# EAGLE schematic IVEEDRIS-SCIR (EAGLE 9.0.1)

## Sheet 1 of 5
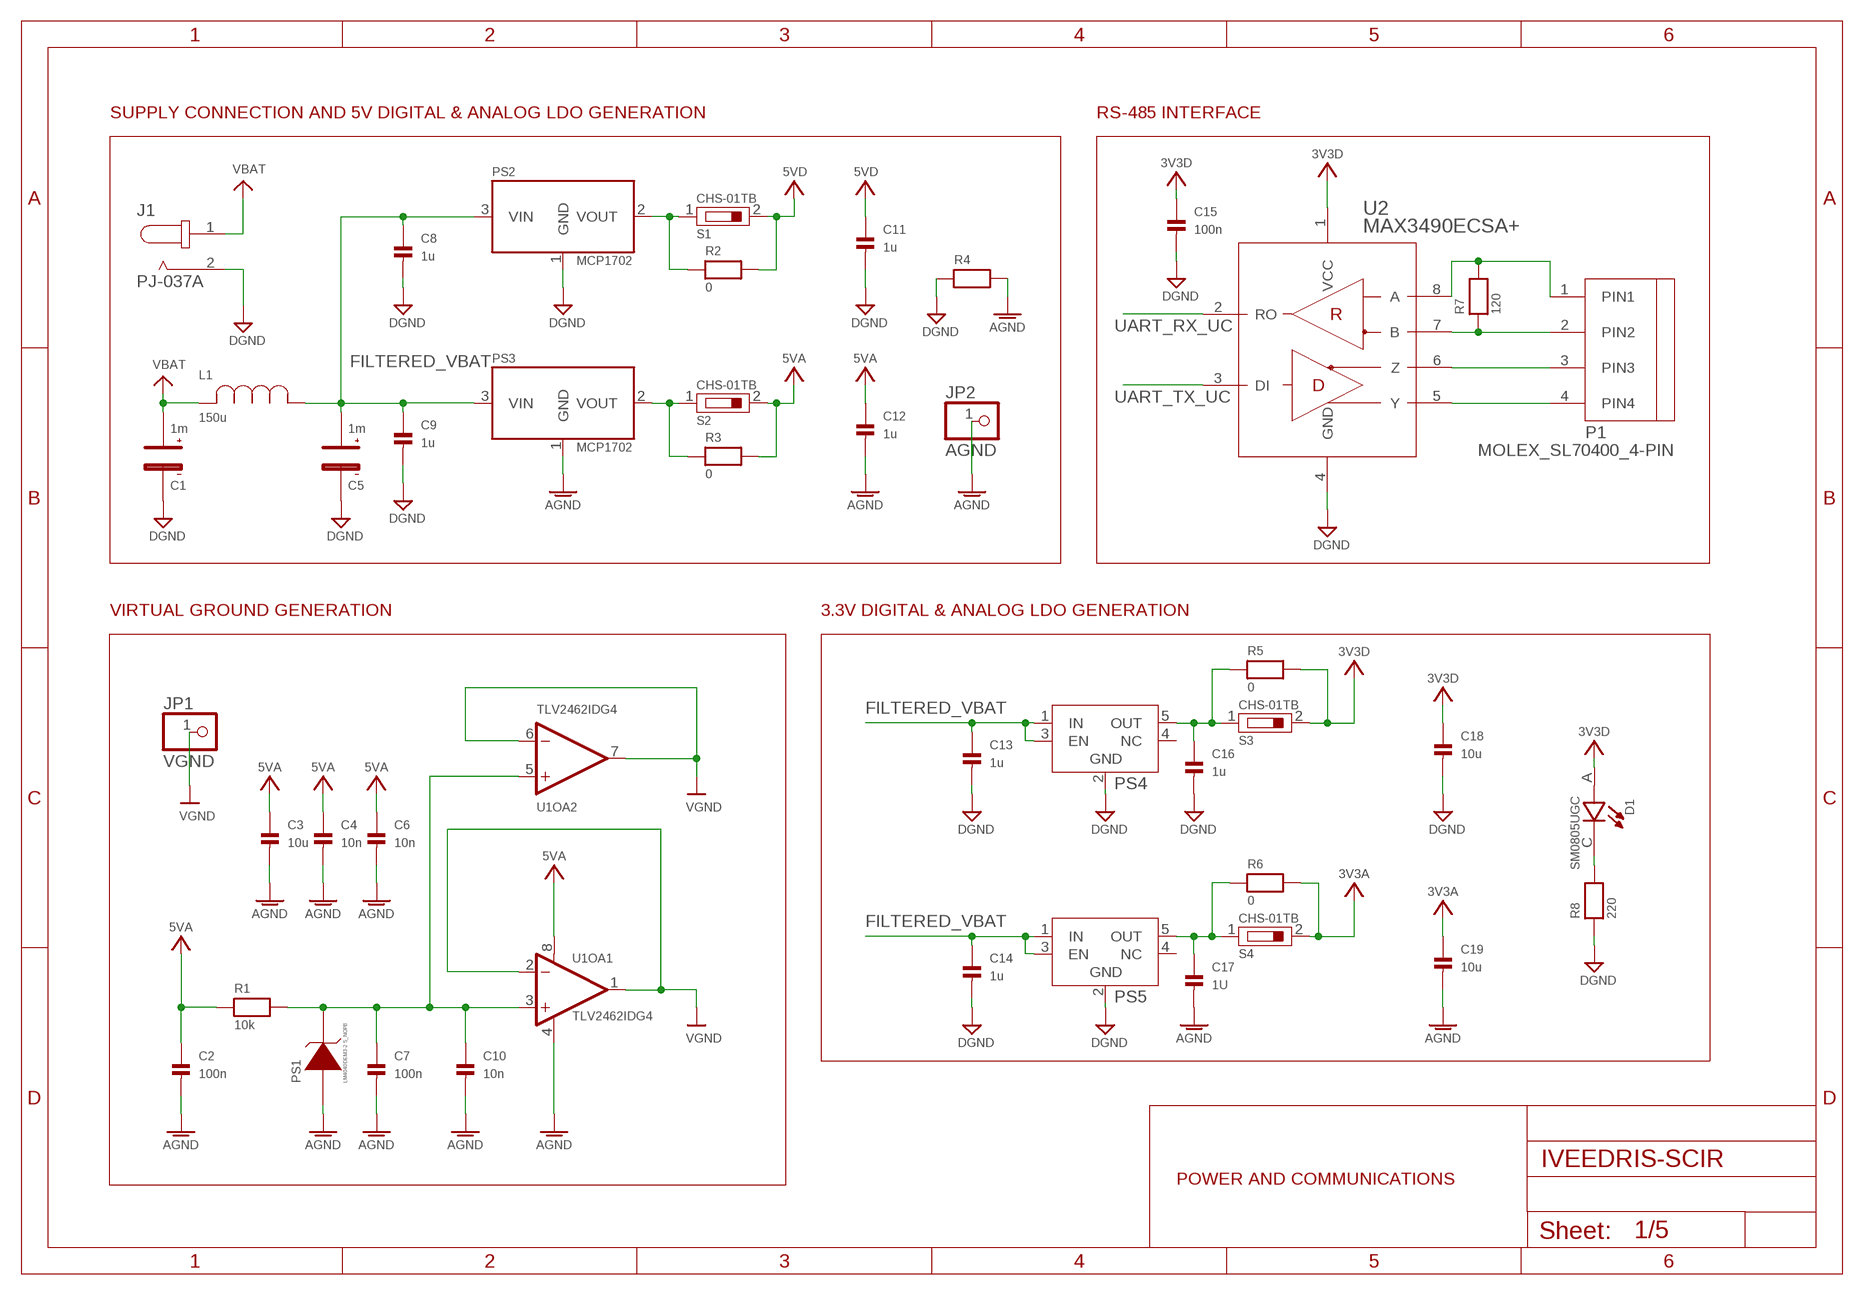
[diagram p0: schematic, sheet 1]

### Parts
C1  1m  APSG160ELL102MH20S  [CAP_ALUMINIUM]
C2  100n  CAP_CERAMIC0805  [0805]
C3  10u  CAP_CERAMIC0805  [0805]
C4  10n  CAP_CERAMIC0805  [0805]
C5  1m  APSG160ELL102MH20S  [CAP_ALUMINIUM]
C6  10n  CAP_CERAMIC0805  [0805]
C7  100n  CAP_CERAMIC0805  [0805]
C8  1u  CAP_CERAMIC0805  [0805]
C9  1u  CAP_CERAMIC0805  [0805]
C10  10n  CAP_CERAMIC0805  [0805]
C11  1u  CAP_CERAMIC0805  [0805]
C12  1u  CAP_CERAMIC0805  [0805]
C13  1u  CAP_CERAMIC0805  [0805]
C14  1u  CAP_CERAMIC0805  [0805]
C15  100n  CAP_CERAMIC0805  [0805]
C16  1u  CAP_CERAMIC0805  [0805]
C17  1U  CAP_CERAMIC0805  [0805]
C18  10u  CAP_CERAMIC0805  [0805]
C19  10u  CAP_CERAMIC0805  [0805]
D1  SM0805UGC  [LEDC2012X135N]
J1  PJ-037A  [CUI_PJ-037A]
JP1  VGND  HEADER-1X1  [1X01_OVAL]
JP2  AGND  HEADER-1X1  [1X01_OVAL]
L1  150u  PM3308-151M-RC  [IND_PM3308-RC]
P1  MOLEX_SL70400_4-PIN  [MOLEX_SL70400_4-PIN]
PS1  LM4040DEM3-2.5_NOPB  [SOT95P237X112-3N]
PS2  MCP1702  [SOT23-A]
PS3  MCP1702  [SOT23-A]
PS4  MCP1802T-3302I/OT  [TSOT-23_S5]
PS5  MCP1802T-3302I/OT  [TSOT-23_S5]
R1  10k  RESISTOR0805  [0805]
R2  0  RESISTOR0805  [0805]
R3  0  RESISTOR0805  [0805]
R4  RESISTOR0402  [0402]
R5  0  RESISTOR0805  [0805]
R6  0  RESISTOR0805  [0805]
R7  120  RESISTOR0805  [0805]
R8  220  RESISTOR0805  [0805]
S1  CHS-01TB  [CHS-01TB]
S2  CHS-01TB  [CHS-01TB]
S3  CHS-01TB  [CHS-01TB]
S4  CHS-01TB  [CHS-01TB]
U1  TLV2462IDG4  [SO8]
U2  MAX3490ECSA+  [SOIC127P600X175-8N]

### Nets
3V3A: C19.1 R6.2 S4.2 ; also sheet 2
3V3D: C15.1 C18.1 D1.A R5.2 S3.2 U2.1(VCC) ; also sheet 2
5VA: C2.1 C3.1 C4.1 C6.1 C12.1 R1.1 R3.2 S2.2 U1.8(OA1:V+) ; also sheet 4
5VD: C11.1 R2.2 S1.2 ; also sheet 3
AGND: C2.2 C3.2 C4.2 C6.2 C7.2 C10.2 C12.2 C17.2 C19.2 JP2.1 PS1.2(ANODE) PS3.1(GND) R4.2 U1.4(OA1:V-) ; also sheet 2,4,5
DGND: C1.2 C5.2 C8.2 C9.2 C11.2 C13.2 C14.2 C15.2 C16.2 C18.2 J1.2 PS2.1(GND) PS4.2(GND) PS5.2(GND) R4.1 R8.1 U2.4(GND) ; also sheet 2,3
FILTERED_VBAT: C5.1 C8.1 C9.1 C13.1 C14.1 L1.1 PS2.3(VIN) PS3.3(VIN) PS4.1(IN) PS4.3(EN) PS5.1(IN) PS5.3(EN)
N$11: PS3.2(VOUT) R3.1 S2.1
N$14: P1.4(PIN4) U2.5(Y)
N$17: C7.1 C10.1 PS1.1(CATHODE) R1.2 U1.3(OA1:+IN) U1.5(OA2:+IN)
N$21: PS2.2(VOUT) R2.1 S1.1
N$23: P1.3(PIN3) U2.6(Z)
N$29: C17.1 PS5.5(OUT) R6.1 S4.1
N$30: C16.1 PS4.5(OUT) R5.1 S3.1
N$36: D1.C R8.2
N$40: P1.2(PIN2) R7.1 U2.7(B)
N$41: P1.1(PIN1) R7.2 U2.8(A)
UART_RX_UC: U2.2(RO) ; also sheet 2
UART_TX_UC: U2.3(DI) ; also sheet 2
VBAT: C1.1 J1.1 L1.2
VGND: JP1.1 U1.1(OA1:OUT) U1.2(OA1:-IN) U1.6(OA2:-IN) U1.7(OA2:OUT) ; also sheet 4,5
Unconnected: PS1.3(NC) PS4.4(NC) PS5.4(NC)

### Notes on the sheet
- SUPPLY CONNECTION AND 5V DIGITAL & ANALOG LDO GENERATION | RS-485 INTERFACE
- VIRTUAL GROUND GENERATION | 3.3V DIGITAL & ANALOG LDO GENERATION
- POWER AND COMMUNICATIONS

## Sheet 2 of 5
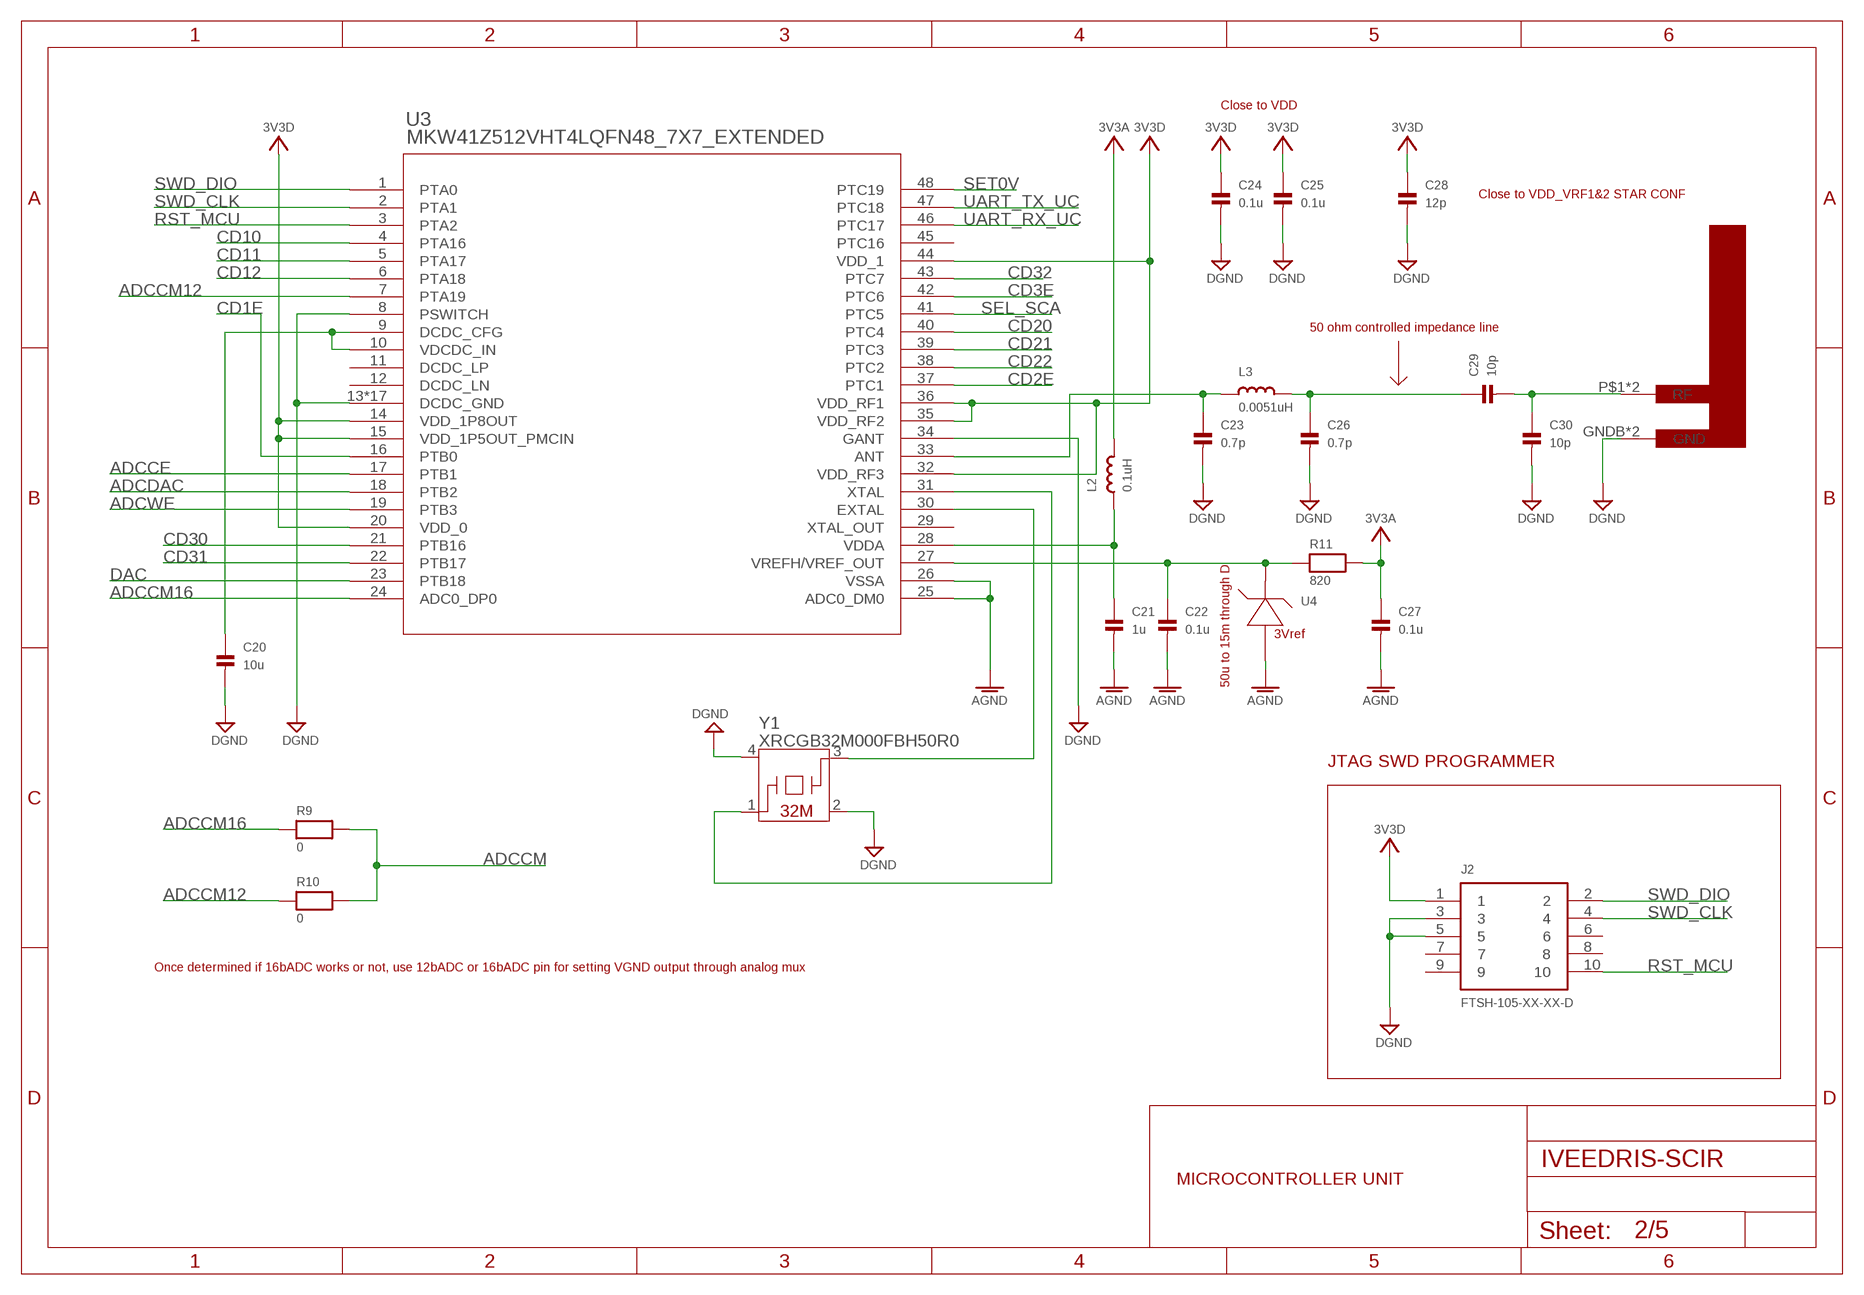
[diagram p1: schematic, sheet 2]

### Parts
AE1  F_INVERTED_ANTENNA_2.4G  [RF2.4GHZ_FINVERTED_ANTENNA]
C20  10u  CAP_CERAMIC0805  [0805]
C21  1u  CAP_CERAMIC0805  [0805]
C22  0.1u  CAP_CERAMIC0805  [0805]
C23  0.7p  CAP_CERAMIC0805  [0805]
C24  0.1u  CAP_CERAMIC0805  [0805]
C25  0.1u  CAP_CERAMIC0805  [0805]
C26  0.7p  CAP_CERAMIC0805  [0805]
C27  0.1u  CAP_CERAMIC0805  [0805]
C28  12p  CAP_CERAMIC0805  [0805]
C29  10p  CAP_CERAMIC0805  [0805]
C30  10p  CAP_CERAMIC0805  [0805]
J2  FTSH-105-XX-XX-D  [FTSH-105-XX-XX-D]
L2  0.1uH  INDUCTOR0805  [0805]
L3  0.0051uH  INDUCTOR0805  [0805]
R9  0  RESISTOR0805  [0805]
R10  0  RESISTOR0805  [0805]
R11  820  RESISTOR0805  [0805]
U3  MKW41Z512VHT4LQFN48_7X7_EXTENDED  [LQFN48_7X7_EXTENDED]
U4  ADR5043BKSZ-REEL7KS_3_ADI-M  [KS_3_ADI-M]
Y1  XRCGB32M000FBH50R0  [XRCGB32_F]

### Nets
3V3A: C27.1 L2.2 R11.2 ; also sheet 1
3V3D: C24.1 C25.1 C28.1 J2.1 U3.14(VDD_1P8OUT) U3.15(VDD_1P5OUT_PMCIN) U3.20(VDD_0) U3.32(VDD_RF3) U3.35(VDD_RF2) U3.36(VDD_RF1) U3.44(VDD_1) ; also sheet 1
ADCCE: U3.17(PTB1) ; also sheet 4
ADCCM: R9.2 R10.2 ; also sheet 4
ADCCM12: R10.1 U3.7(PTA19)
ADCCM16: R9.1 U3.24(ADC0_DP0)
ADCDAC: U3.18(PTB2) ; also sheet 4
ADCWE: U3.19(PTB3) ; also sheet 4
AGND: C21.2 C22.2 C27.2 U3.25(ADC0_DM0) U3.26(VSSA) U4.2(V-) ; also sheet 1,4,5
CD1E: U3.16(PTB0) ; also sheet 3
CD2E: U3.37(PTC1) ; also sheet 3
CD3E: U3.42(PTC6) ; also sheet 3
CD10: U3.4(PTA16) ; also sheet 3
CD11: U3.5(PTA17) ; also sheet 3
CD12: U3.6(PTA18) ; also sheet 3
CD20: U3.40(PTC4) ; also sheet 3
CD21: U3.39(PTC3) ; also sheet 3
CD22: U3.38(PTC2) ; also sheet 3
CD30: U3.21(PTB16) ; also sheet 3
CD31: U3.22(PTB17) ; also sheet 3
CD32: U3.43(PTC7) ; also sheet 3
DAC: U3.23(PTB18) ; also sheet 4
DGND: AE1.GNDB(GND) AE1.GNDT(GND) C20.2 C23.2 C24.2 C25.2 C26.2 C28.2 C30.2 J2.3 J2.5 U3.8(PSWITCH) U3.13(DCDC_GND) U3.34(GANT) U3.49(DCDC_GND) U3.50(DCDC_GND) U3.51(DCDC_GND) U3.52(DCDC_GND) U3.53(DCDC_GND) U3.54(DCDC_GND) U3.55(DCDC_GND) U3.56(DCDC_GND) U3.57(DCDC_GND) U3.58(DCDC_GND) U3.59(DCDC_GND) U3.60(DCDC_GND) U3.61(DCDC_GND) U3.62(DCDC_GND) U3.63(DCDC_GND) U3.64(DCDC_GND) Y1.2(NC_1) Y1.4(NC_2) ; also sheet 1,3
N$2: C21.1 L2.1 U3.28(VDDA)
N$12: C20.1 U3.9(DCDC_CFG) U3.10(VDCDC_IN)
N$20: C22.1 R11.1 U3.27(VREFH/VREF_OUT) U4.1(V+)
N$31: U3.31(XTAL) Y1.1(CRYSTAL_1)
N$32: U3.30(EXTAL) Y1.3(CRYSTAL_2)
N$33: C23.1 L3.1 U3.33(ANT)
N$34: C26.1 C29.1 L3.2
N$35: AE1.P$1(RF) AE1.RF C29.2 C30.1
RST_MCU: J2.10 U3.3(PTA2)
SEL_SCA: U3.41(PTC5) ; also sheet 4
SET0V: U3.48(PTC19) ; also sheet 4
SWD_CLK: J2.4 U3.2(PTA1)
SWD_DIO: J2.2 U3.1(PTA0)
UART_RX_UC: U3.46(PTC17) ; also sheet 1
UART_TX_UC: U3.47(PTC18) ; also sheet 1
Unconnected: J2.6 J2.7 J2.8 J2.9 U3.11(DCDC_LP) U3.12(DCDC_LN) U3.29(XTAL_OUT) U3.45(PTC16) U4.3(NC)

### Notes on the sheet
- Close to VDD
- Close to VDD_VRF1&2 STAR CONF
- 50 ohm controlled impedance line
- 50u to 15m through D
- JTAG SWD PROGRAMMER
- Once determined if 16bADC works or not, use 12bADC or 16bADC pin for setting VGND output through analog mux
- MICROCONTROLLER UNIT

## Sheet 3 of 5
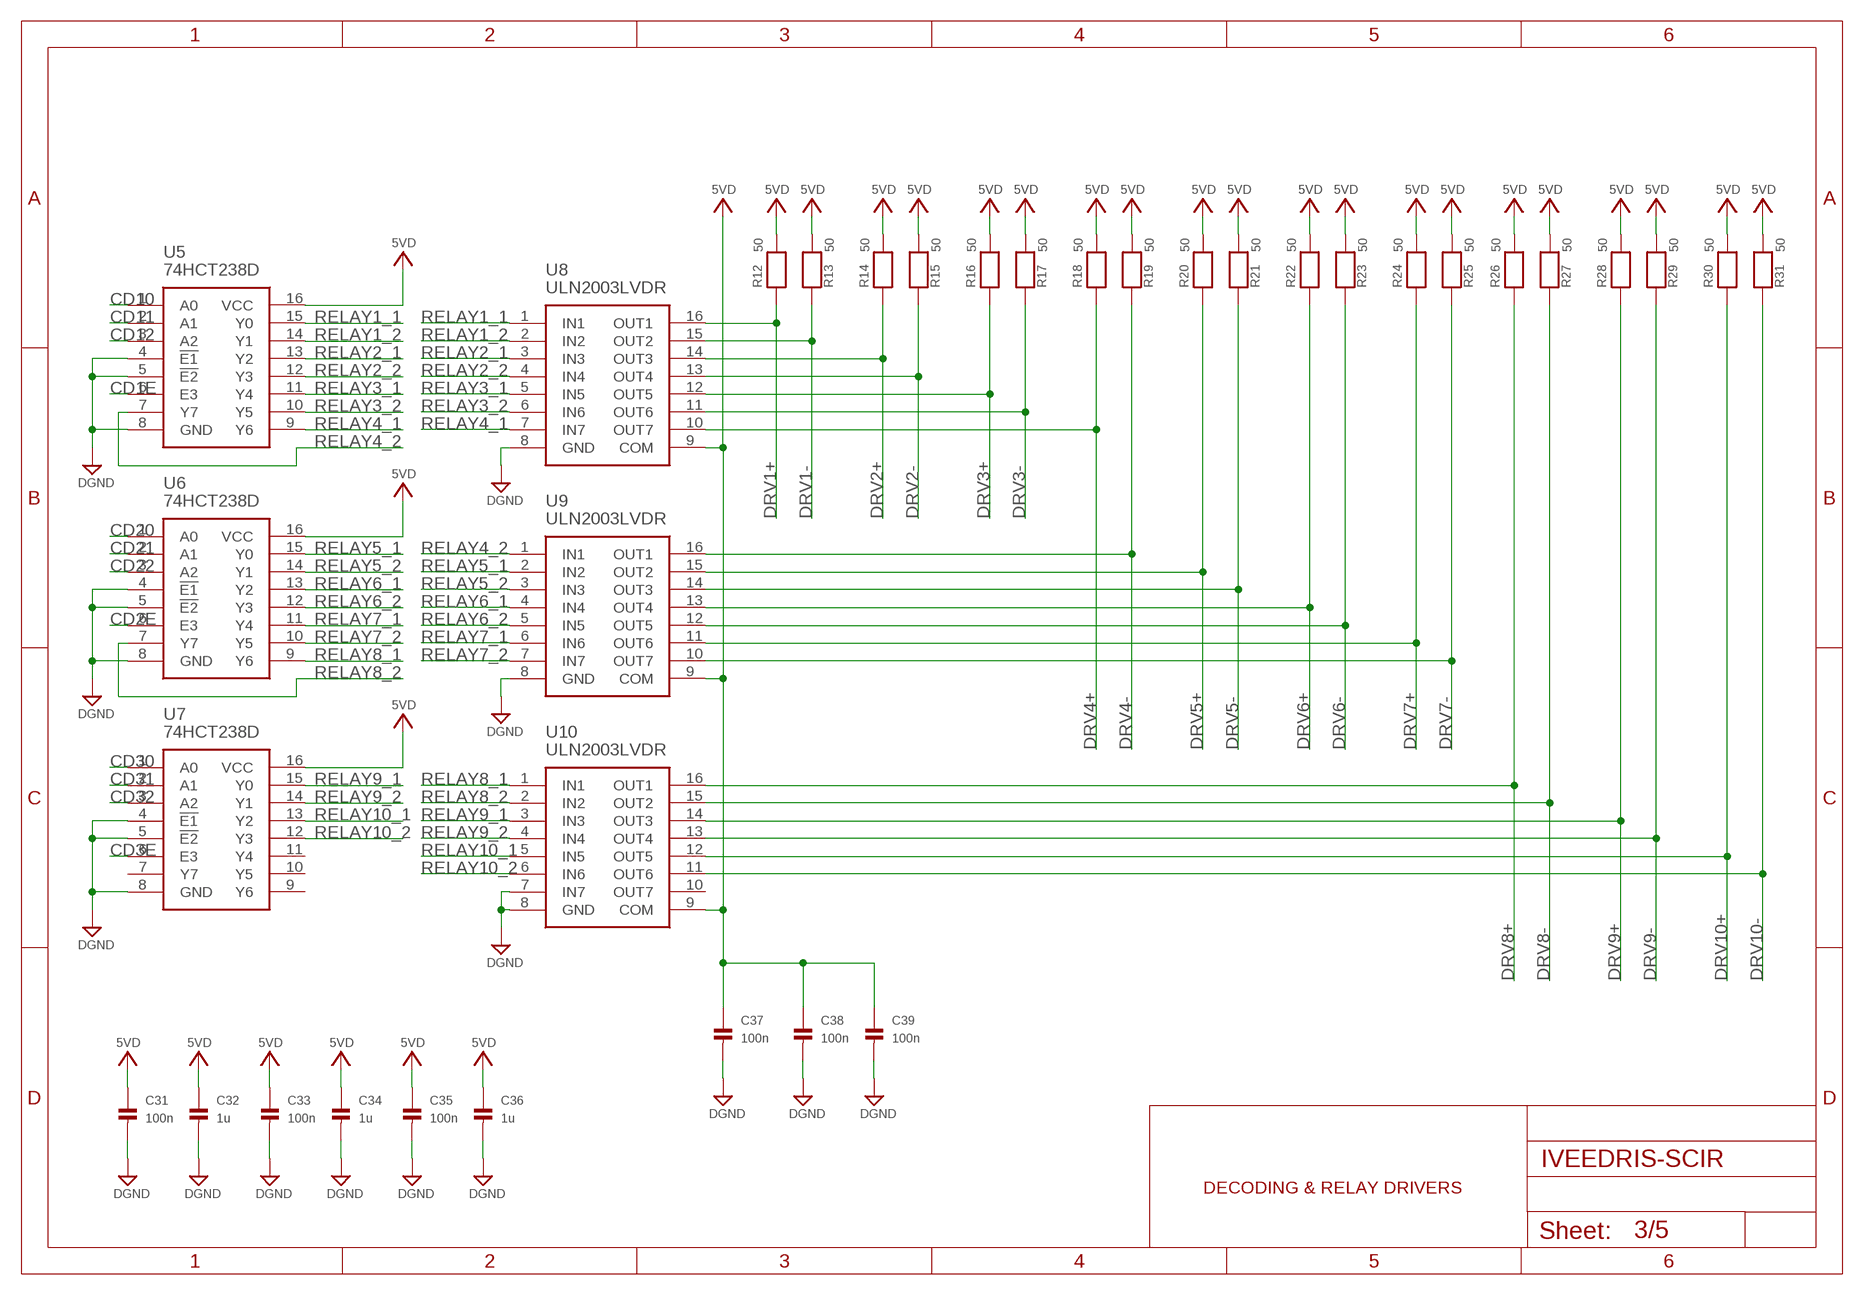
[diagram p2: schematic, sheet 3]

### Parts
C31  100n  CAP_CERAMIC0805  [0805]
C32  1u  CAP_CERAMIC0805  [0805]
C33  100n  CAP_CERAMIC0805  [0805]
C34  1u  CAP_CERAMIC0805  [0805]
C35  100n  CAP_CERAMIC0805  [0805]
C36  1u  CAP_CERAMIC0805  [0805]
C37  100n  CAP_CERAMIC0805  [0805]
C38  100n  CAP_CERAMIC0805  [0805]
C39  100n  CAP_CERAMIC0805  [0805]
R12  50  RESISTOR0805  [0805]
R13  50  RESISTOR0805  [0805]
R14  50  RESISTOR0805  [0805]
R15  50  RESISTOR0805  [0805]
R16  50  RESISTOR0805  [0805]
R17  50  RESISTOR0805  [0805]
R18  50  RESISTOR0805  [0805]
R19  50  RESISTOR0805  [0805]
R20  50  RESISTOR0805  [0805]
R21  50  RESISTOR0805  [0805]
R22  50  RESISTOR0805  [0805]
R23  50  RESISTOR0805  [0805]
R24  50  RESISTOR0805  [0805]
R25  50  RESISTOR0805  [0805]
R26  50  RESISTOR0805  [0805]
R27  50  RESISTOR0805  [0805]
R28  50  RESISTOR0805  [0805]
R29  50  RESISTOR0805  [0805]
R30  50  RESISTOR0805  [0805]
R31  50  RESISTOR0805  [0805]
U5  74HCT238D  [SOIC127P600X175-16N]
U6  74HCT238D  [SOIC127P600X175-16N]
U7  74HCT238D  [SOIC127P600X175-16N]
U8  ULN2003LVDR  [SOIC127P600X175-16N]
U9  ULN2003LVDR  [SOIC127P600X175-16N]
U10  ULN2003LVDR  [SOIC127P600X175-16N]

### Nets
5VD: C31.1 C32.1 C33.1 C34.1 C35.1 C36.1 C37.1 C38.1 C39.1 R12.2 R13.2 R14.2 R15.2 R16.2 R17.2 R18.2 R19.2 R20.2 R21.2 R22.2 R23.2 R24.2 R25.2 R26.2 R27.2 R28.2 R29.2 R30.2 R31.2 U5.16(VCC) U6.16(VCC) U7.16(VCC) U8.9(COM) U9.9(COM) U10.9(COM) ; also sheet 1
CD1E: U5.6(E3) ; also sheet 2
CD2E: U6.6(E3) ; also sheet 2
CD3E: U7.6(E3) ; also sheet 2
CD10: U5.1(A0) ; also sheet 2
CD11: U5.2(A1) ; also sheet 2
CD12: U5.3(A2) ; also sheet 2
CD20: U6.1(A0) ; also sheet 2
CD21: U6.2(A1) ; also sheet 2
CD22: U6.3(A2) ; also sheet 2
CD30: U7.1(A0) ; also sheet 2
CD31: U7.2(A1) ; also sheet 2
CD32: U7.3(A2) ; also sheet 2
DGND: C31.2 C32.2 C33.2 C34.2 C35.2 C36.2 C37.2 C38.2 C39.2 U5.4(!E1) U5.5(!E2) U5.8(GND) U6.4(!E1) U6.5(!E2) U6.8(GND) U7.4(!E1) U7.5(!E2) U7.8(GND) U8.8(GND) U9.8(GND) U10.7(IN7) U10.8(GND) ; also sheet 1,2
DRV1+: R12.1 U8.16(OUT1) ; also sheet 5
DRV1-: R13.1 U8.15(OUT2) ; also sheet 5
DRV2+: R14.1 U8.14(OUT3) ; also sheet 5
DRV2-: R15.1 U8.13(OUT4) ; also sheet 5
DRV3+: R16.1 U8.12(OUT5) ; also sheet 5
DRV3-: R17.1 U8.11(OUT6) ; also sheet 5
DRV4+: R18.1 U8.10(OUT7) ; also sheet 5
DRV4-: R19.1 U9.16(OUT1) ; also sheet 5
DRV5+: R20.1 U9.15(OUT2) ; also sheet 5
DRV5-: R21.1 U9.14(OUT3) ; also sheet 5
DRV6+: R22.1 U9.13(OUT4) ; also sheet 5
DRV6-: R23.1 U9.12(OUT5) ; also sheet 5
DRV7+: R24.1 U9.11(OUT6) ; also sheet 5
DRV7-: R25.1 U9.10(OUT7) ; also sheet 5
DRV8+: R26.1 U10.16(OUT1) ; also sheet 5
DRV8-: R27.1 U10.15(OUT2) ; also sheet 5
DRV9+: R28.1 U10.14(OUT3) ; also sheet 5
DRV9-: R29.1 U10.13(OUT4) ; also sheet 5
DRV10+: R30.1 U10.12(OUT5) ; also sheet 5
DRV10-: R31.1 U10.11(OUT6) ; also sheet 5
RELAY1_1: U5.15(Y0) U8.1(IN1)
RELAY1_2: U5.14(Y1) U8.2(IN2)
RELAY2_1: U5.13(Y2) U8.3(IN3)
RELAY2_2: U5.12(Y3) U8.4(IN4)
RELAY3_1: U5.11(Y4) U8.5(IN5)
RELAY3_2: U5.10(Y5) U8.6(IN6)
RELAY4_1: U5.9(Y6) U8.7(IN7)
RELAY4_2: U5.7(Y7) U9.1(IN1)
RELAY5_1: U6.15(Y0) U9.2(IN2)
RELAY5_2: U6.14(Y1) U9.3(IN3)
RELAY6_1: U6.13(Y2) U9.4(IN4)
RELAY6_2: U6.12(Y3) U9.5(IN5)
RELAY7_1: U6.11(Y4) U9.6(IN6)
RELAY7_2: U6.10(Y5) U9.7(IN7)
RELAY8_1: U6.9(Y6) U10.1(IN1)
RELAY8_2: U6.7(Y7) U10.2(IN2)
RELAY9_1: U7.15(Y0) U10.3(IN3)
RELAY9_2: U7.14(Y1) U10.4(IN4)
RELAY10_1: U7.13(Y2) U10.5(IN5)
RELAY10_2: U7.12(Y3) U10.6(IN6)
Unconnected: U7.7(Y7) U7.9(Y6) U7.10(Y5) U7.11(Y4) U10.10(OUT7)

### Notes on the sheet
- DECODING & RELAY DRIVERS

## Sheet 4 of 5
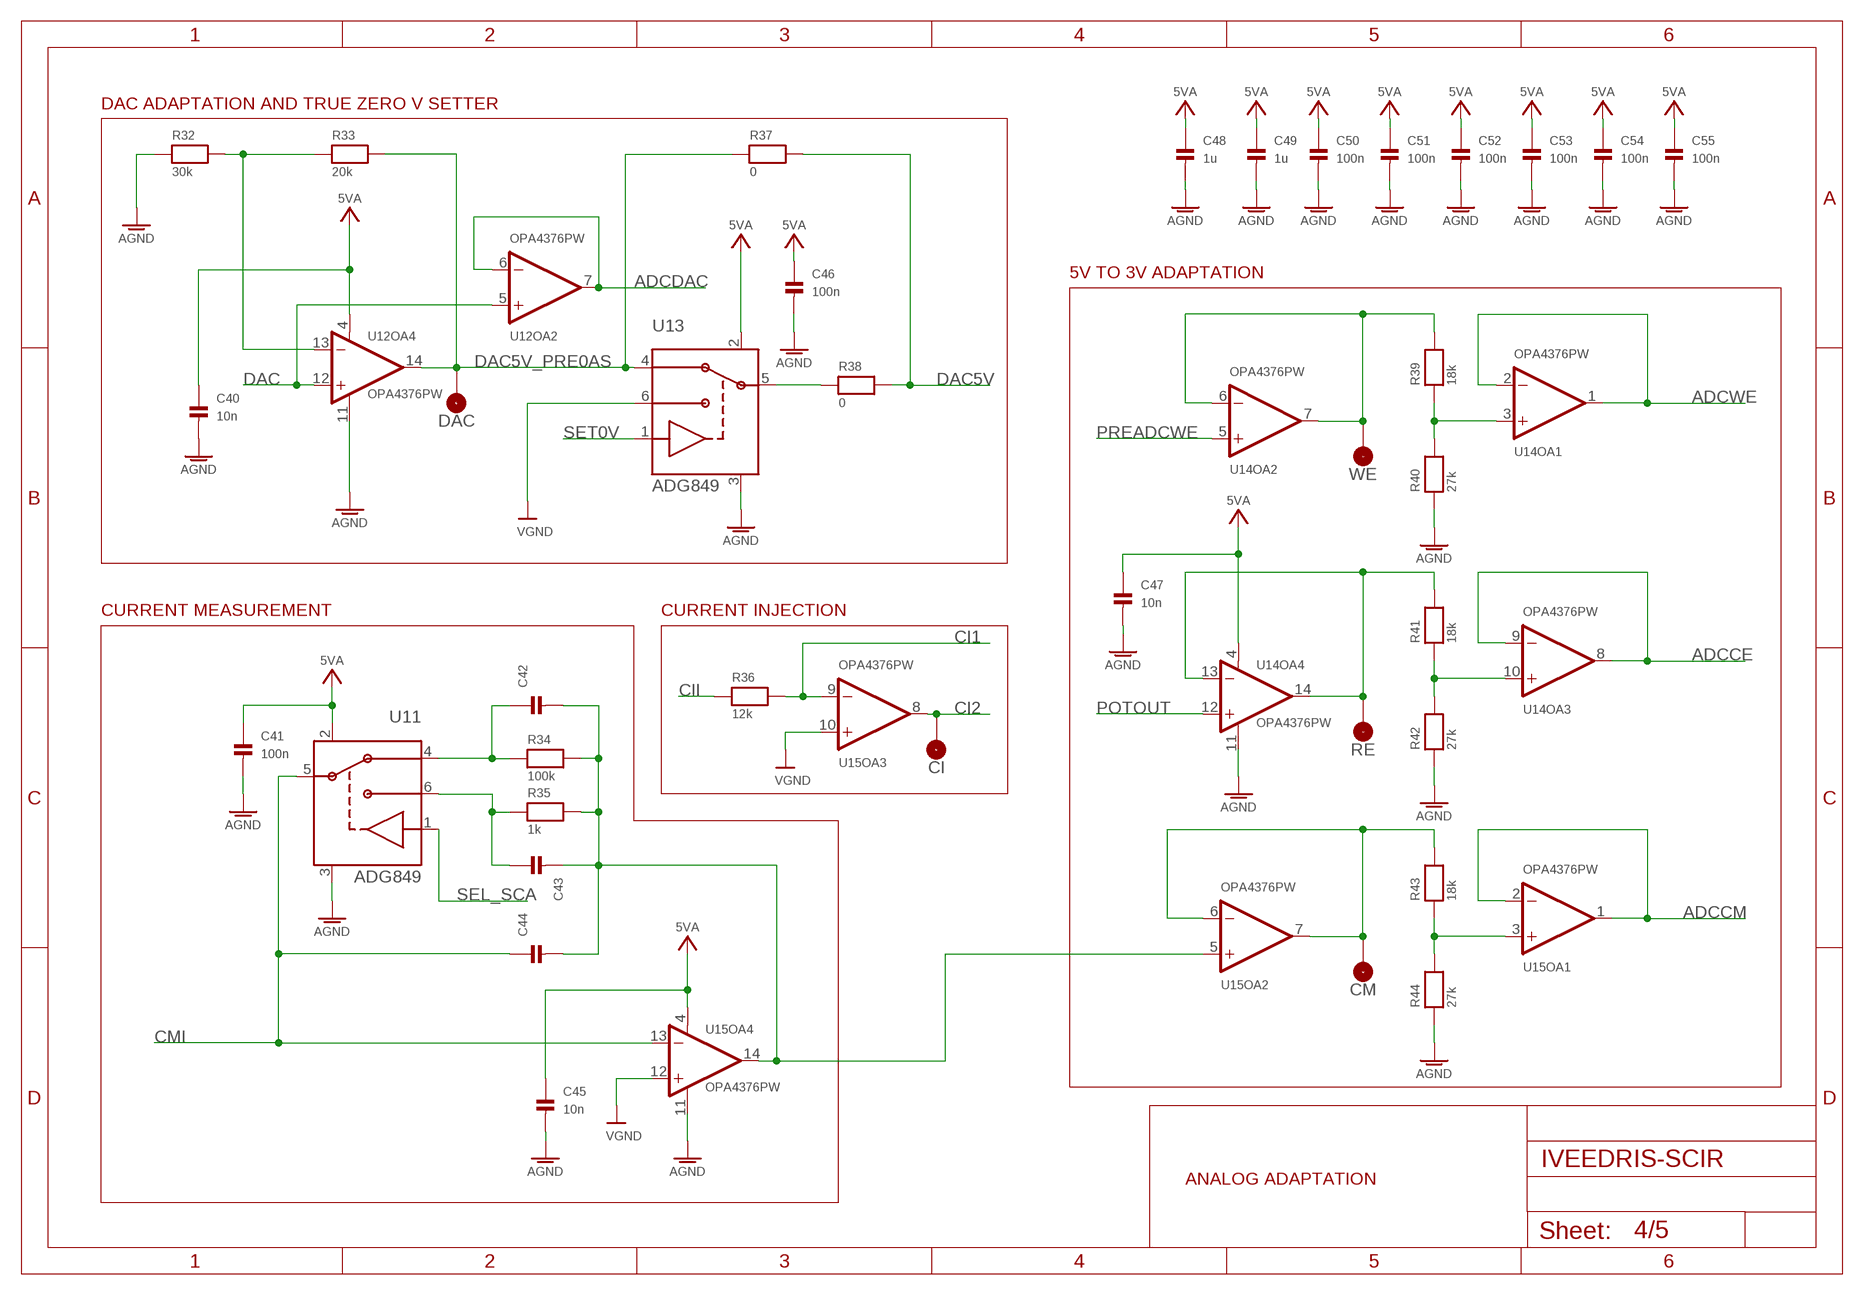
[diagram p3: schematic, sheet 4]

### Parts
C40  10n  CAP_CERAMIC0805  [0805]
C41  100n  CAP_CERAMIC0805  [0805]
C42  CAP_CERAMIC0805  [0805]
C43  CAP_CERAMIC0805  [0805]
C44  CAP_CERAMIC0805  [0805]
C45  10n  CAP_CERAMIC0805  [0805]
C46  100n  CAP_CERAMIC0805  [0805]
C47  10n  CAP_CERAMIC0805  [0805]
C48  1u  CAP_CERAMIC0805  [0805]
C49  1u  CAP_CERAMIC0805  [0805]
C50  100n  CAP_CERAMIC0805  [0805]
C51  100n  CAP_CERAMIC0805  [0805]
C52  100n  CAP_CERAMIC0805  [0805]
C53  100n  CAP_CERAMIC0805  [0805]
C54  100n  CAP_CERAMIC0805  [0805]
C55  100n  CAP_CERAMIC0805  [0805]
CI  TESTPOINT  [NOSOLDERPAD]
CM  TESTPOINT  [NOSOLDERPAD]
DAC  TESTPOINT  [NOSOLDERPAD]
R32  30k  RESISTOR0805  [0805]
R33  20k  RESISTOR0805  [0805]
R34  100k  RESISTOR1206  [1206]
R35  1k  RESISTOR1206  [1206]
R36  12k  RESISTOR1206  [1206]
R37  0  RESISTOR0805  [0805]
R38  0  RESISTOR0805  [0805]
R39  18k  RESISTOR0805  [0805]
R40  27k  RESISTOR0805  [0805]
R41  18k  RESISTOR0805  [0805]
R42  27k  RESISTOR0805  [0805]
R43  18k  RESISTOR0805  [0805]
R44  27k  RESISTOR0805  [0805]
RE  TESTPOINT  [NOSOLDERPAD]
U11  ADG849  [SC70-6L]
U12  OPA4376PW  [TSSOP14-NOTHERMALPAD]
U13  ADG849  [SC70-6L]
U14  OPA4376PW  [TSSOP14-NOTHERMALPAD]
U15  OPA4376PW  [TSSOP14-NOTHERMALPAD]
WE  TESTPOINT  [NOSOLDERPAD]

### Nets
5VA: C40.1 C41.1 C45.1 C46.1 C47.1 C48.1 C49.1 C50.1 C51.1 C52.1 C53.1 C54.1 C55.1 U11.2(VDD) U12.4(OA4:V+) U13.2(VDD) U14.4(OA4:V+) U15.4(OA4:V+) ; also sheet 1
ADCCE: U14.8(OA3:OUT) U14.9(OA3:-IN) ; also sheet 2
ADCCM: U15.1(OA1:OUT) U15.2(OA1:-IN) ; also sheet 2
ADCDAC: U12.6(OA2:-IN) U12.7(OA2:OUT) ; also sheet 2
ADCWE: U14.1(OA1:OUT) U14.2(OA1:-IN) ; also sheet 2
AGND: C40.2 C41.2 C45.2 C46.2 C47.2 C48.2 C49.2 C50.2 C51.2 C52.2 C53.2 C54.2 C55.2 R32.1 R40.1 R42.1 R44.1 U11.3(GND) U12.11(OA4:V-) U13.3(GND) U14.11(OA4:V-) U15.11(OA4:V-) ; also sheet 1,2,5
CI1: R36.2 U15.9(OA3:-IN) ; also sheet 5
CI2: CI.P$1 U15.8(OA3:OUT) ; also sheet 5
CII: R36.1 ; also sheet 5
CMI: C44.1 U11.5(D) U15.13(OA4:-IN) ; also sheet 5
DAC: U12.5(OA2:+IN) U12.12(OA4:+IN) ; also sheet 2
DAC5V: R37.2 R38.2 ; also sheet 5
DAC5V_PRE0AS: DAC.P$1 R33.2 R37.1 U12.14(OA4:OUT) U13.4(S1)
HHHHH: C42.2 C43.2 C44.2 R34.2 R35.2 U15.5(OA2:+IN) U15.14(OA4:OUT)
N$1: R38.1 U13.5(D)
N$3: R41.1 R42.2 U14.10(OA3:+IN)
N$8: R43.1 R44.2 U15.3(OA1:+IN)
N$9: R41.2 RE.P$1 U14.13(OA4:-IN) U14.14(OA4:OUT)
N$13: R39.1 R40.2 U14.3(OA1:+IN)
N$18: R39.2 U14.6(OA2:-IN) U14.7(OA2:OUT) WE.P$1
N$22: CM.P$1 R43.2 U15.6(OA2:-IN) U15.7(OA2:OUT)
N$24: R32.2 R33.1 U12.13(OA4:-IN)
N$47: C42.1 R34.1 U11.4(S1)
N$48: C43.1 R35.1 U11.6(S2)
POTOUT: U14.12(OA4:+IN) ; also sheet 5
PREADCWE: U14.5(OA2:+IN) ; also sheet 5
SEL_SCA: U11.1(IN) ; also sheet 2
SET0V: U13.1(IN) ; also sheet 2
VGND: U13.6(S2) U15.10(OA3:+IN) U15.12(OA4:+IN) ; also sheet 1,5

### Notes on the sheet
- DAC ADAPTATION AND TRUE ZERO V SETTER
- 5V TO 3V ADAPTATION
- CURRENT MEASUREMENT | CURRENT INJECTION
- ANALOG ADAPTATION

## Sheet 5 of 5
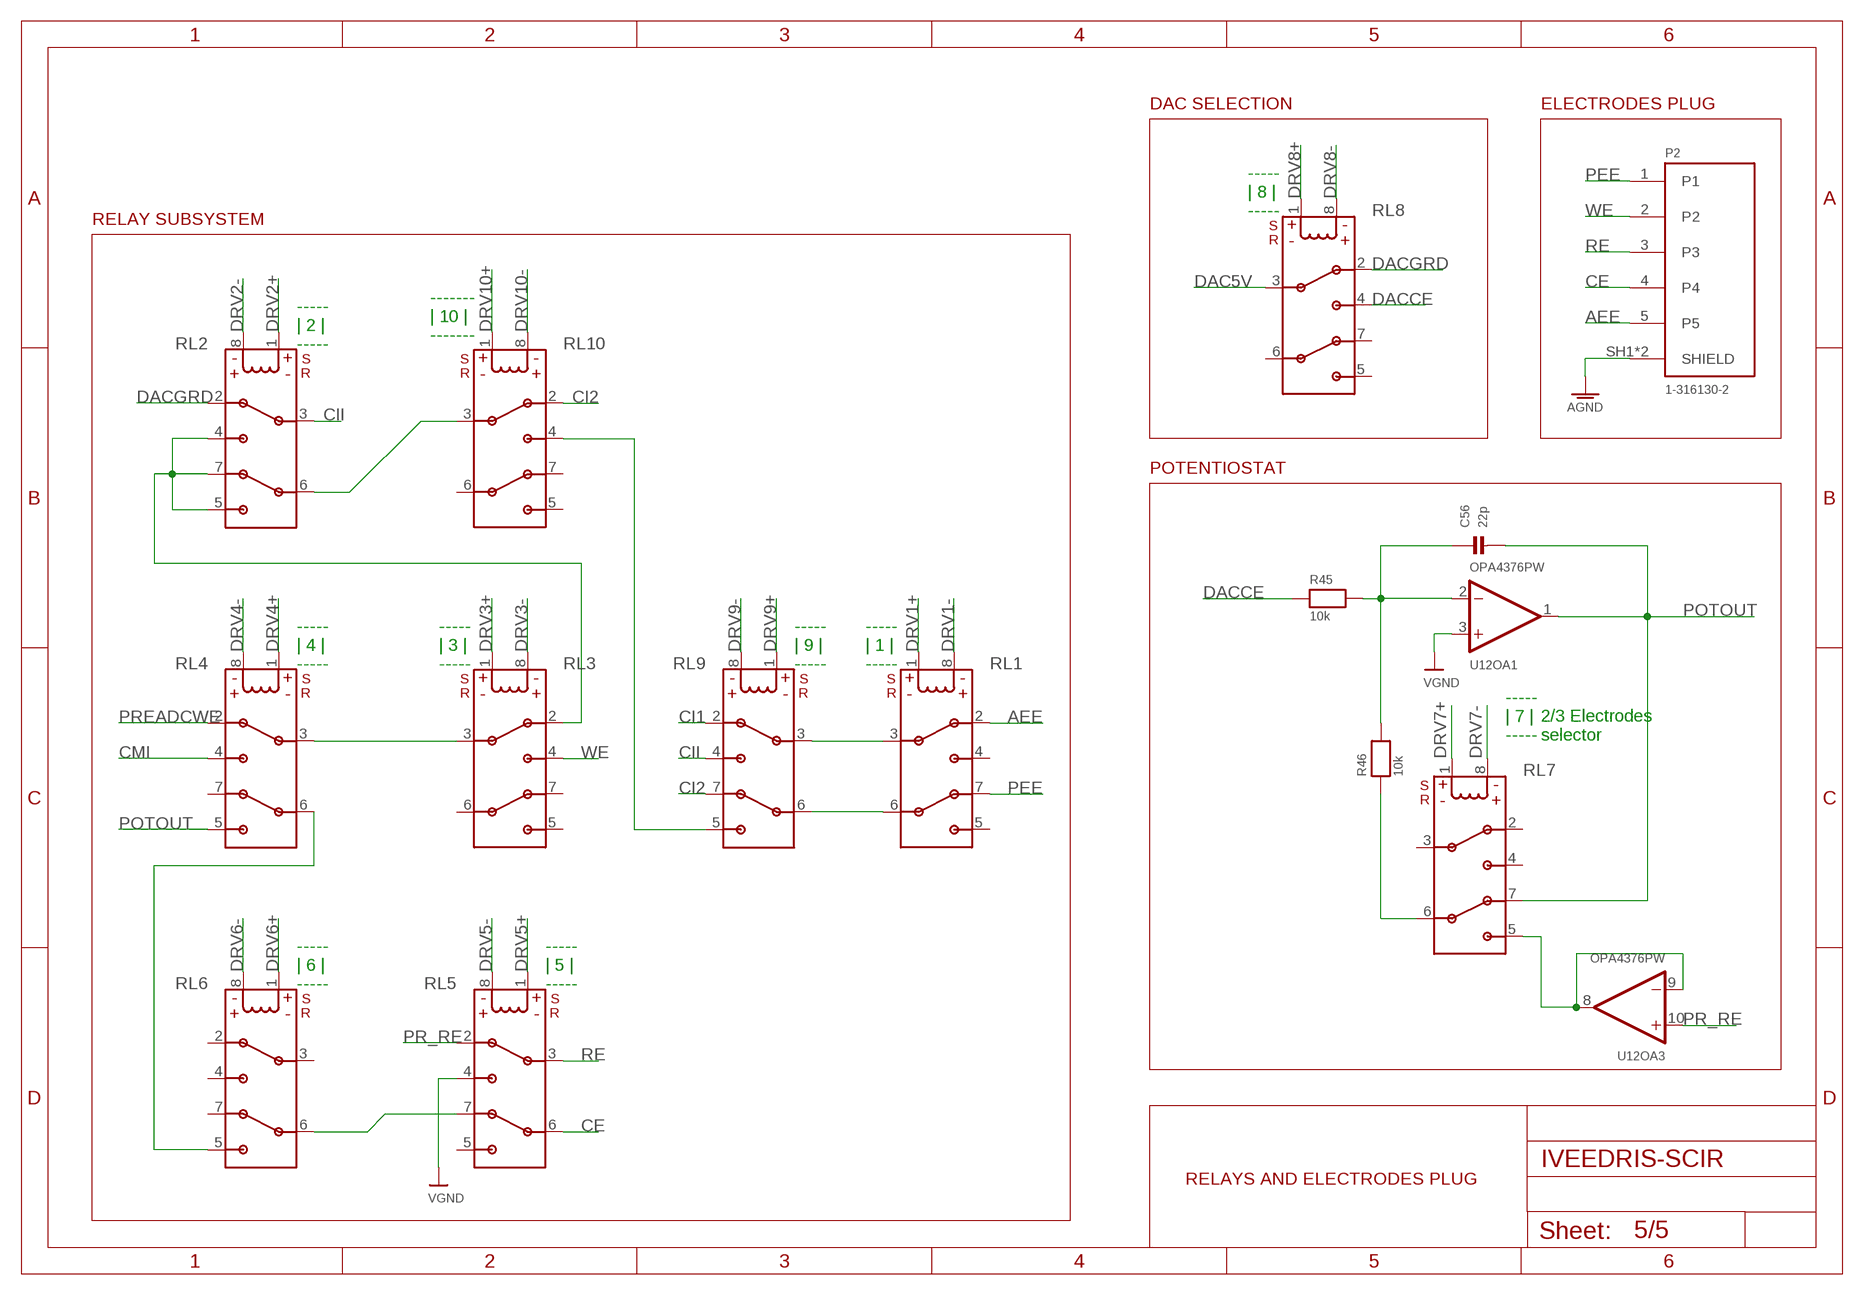
[diagram p4: schematic, sheet 5]

### Parts
C56  22p  CAP_CERAMIC0805  [0805]
P2  1-316130-2  [TE_1-316130-2]
R45  10k  RESISTOR0805  [0805]
R46  10k  RESISTOR0805  [0805]
RL1  G6KU-2F-Y  [G6KU-2F-Y]
RL2  G6KU-2F-Y  [G6KU-2F-Y]
RL3  G6KU-2F-Y  [G6KU-2F-Y]
RL4  G6KU-2F-Y  [G6KU-2F-Y]
RL5  G6KU-2F-Y  [G6KU-2F-Y]
RL6  G6KU-2F-Y  [G6KU-2F-Y]
RL7  G6KU-2F-Y  [G6KU-2F-Y]
RL8  G6KU-2F-Y  [G6KU-2F-Y]
RL9  G6KU-2F-Y  [G6KU-2F-Y]
RL10  G6KU-2F-Y  [G6KU-2F-Y]

### Nets
AEE: P2.5 RL1.2
AGND: P2.SH1(SHIELD) P2.SH2(SHIELD) ; also sheet 1,2,4
CE: P2.4 RL5.6
CI1: RL9.2 ; also sheet 4
CI2: RL9.7 RL10.2 ; also sheet 4
CII: RL2.3 RL9.4 ; also sheet 4
CMI: RL4.4 ; also sheet 4
DAC5V: RL8.3 ; also sheet 4
DACCE: R45.1 RL8.4
DACGRD: RL2.2 RL8.2
DRV1+: RL1.1(L+) ; also sheet 3
DRV1-: RL1.8(L-) ; also sheet 3
DRV2+: RL2.1(L+) ; also sheet 3
DRV2-: RL2.8(L-) ; also sheet 3
DRV3+: RL3.1(L+) ; also sheet 3
DRV3-: RL3.8(L-) ; also sheet 3
DRV4+: RL4.1(L+) ; also sheet 3
DRV4-: RL4.8(L-) ; also sheet 3
DRV5+: RL5.1(L+) ; also sheet 3
DRV5-: RL5.8(L-) ; also sheet 3
DRV6+: RL6.1(L+) ; also sheet 3
DRV6-: RL6.8(L-) ; also sheet 3
DRV7+: RL7.1(L+) ; also sheet 3
DRV7-: RL7.8(L-) ; also sheet 3
DRV8+: RL8.1(L+) ; also sheet 3
DRV8-: RL8.8(L-) ; also sheet 3
DRV9+: RL9.1(L+) ; also sheet 3
DRV9-: RL9.8(L-) ; also sheet 3
DRV10+: RL10.1(L+) ; also sheet 3
DRV10-: RL10.8(L-) ; also sheet 3
N$4: RL5.7 RL6.6
N$5: RL2.6 RL10.3
N$6: RL1.3 RL9.3
N$7: RL1.6 RL9.6
N$10: RL9.5 RL10.4
N$15: RL2.4 RL2.5 RL2.7 RL3.2
N$16: RL4.6 RL6.5
N$19: RL3.3 RL4.3
N$25: C56.1 R45.2 R46.2 U12.2(OA1:-IN)
PEE: P2.1 RL1.7
POTOUT: C56.2 RL4.5 RL7.7 U12.1(OA1:OUT) ; also sheet 4
PR_RE: RL5.2 U12.10(OA3:+IN)
PREADCCE: R46.1 RL7.6
PREADCRE: RL7.5 U12.8(OA3:OUT) U12.9(OA3:-IN)
PREADCWE: RL4.2 ; also sheet 4
RE: P2.3 RL5.3
VGND: RL5.4 U12.3(OA1:+IN) ; also sheet 1,4
WE: P2.2 RL3.4
Unconnected: RL1.4 RL1.5 RL3.5 RL3.6 RL3.7 RL4.7 RL5.5 RL6.2 RL6.3 RL6.4 RL6.7 RL7.2 RL7.3 RL7.4 RL8.5 RL8.6 RL8.7 RL10.5 RL10.6 RL10.7

### Notes on the sheet
- DAC SELECTION | ELECTRODES PLUG
- -----
  | 8 |
  -----
- RELAY SUBSYSTEM
- -------
  | 10 |
  -------
- -----
  | 2 |
  -----
- POTENTIOSTAT
- -----
  | 4 |
  -----
- -----
  | 3 |
  -----
- -----
  | 9 |
  -----
- -----
  | 1 |
  -----
- -----
  | 7 |
  -----
- 2/3 Electrodes
  selector
- -----
  | 6 |
  -----
- -----
  | 5 |
  -----
- RELAYS AND ELECTRODES PLUG

## Library data of the parts
AE1 = IVEEDRIS-SCIR:F_INVERTED_ANTENNA_2.4G
C1 C5 = IVEEDRIS-SCIR:APSG160ELL102MH20S; DIGIKEY_PRICE-STOCK: https://www.digikey.com/es/products/detail/united-chemi-con/APSG160ELL102MH20S/5824534?s=N4IgTCBcDaIIIAUDKBxAjANgAwFEAyeaWYAsgBJhZIgC6AvkA; MANUFACTURER_NAME: United Chemi-Con; MANUFACTURER_PART_NAME: APSG160ELL102MH20S; SUPPLIER_PART_NAME: 565-4311-ND
C2-C4 C6-C56 = microbuilder:CAP_CERAMIC: Ceramic Capacitors 0402 - 0402 Surface Mount Capacitors 16pF 50V 5% [Digikey: 445-4899-2-ND] 18pF 50V 5% [Digikey: 490-1281-2-ND] 22pF 50V 5% [Digikey: 490-1283-2-ND] 68pF 50V 5% [Digikey: 490-1289-2-ND] 0.1uF 10V 10% [Digikey: 490-1318-2-ND] 1.0uF 6.3V 10% [Digikey: 490-1320-2-ND] 0603 - 0603 Surface Mount Capacitors 16 pF 50V 5% [Digikey: 445-5051-2-ND] 22 pF 50V [Digikey: PCC220ACVTR-ND] 33 pF 50V 5% [Digikey: 490-1415-1-ND] 56pF 50V 5% [Digikey: 490-1421-1-ND] 220pF 50V 5% [Digikey: 445-1285-1-ND] 680 pF 50V 2200 pF 50V 5% C0G [Digikey: 445-1297-1-ND] 5600 pF 100V 5% X7R [Digikey: 478-3711-1-ND] 0.1 µF 25V 10% [Digikey: PCC2277TR-ND] 0.22 µF 16V 10% X7R [Digikey: 445-1318-1-ND] 1.0 µF 25V 10% [Digikey: 445-5146-2-ND] 0603 - RF Specific 3pF 250V +/-0.1pF RF [Digikey: 712-1347-1-ND] 18 pF 250V 5% [Digikey: 478-3505-1-ND or 712-1322-1-ND] 56 pF 250V 5% C0G RF [Digikey: 490-4867-1-ND] 68 pF 250V RF [Digikey: 490-4868-1-ND] 0805 - 0805 Surface Mount Capacitors 220 pF 250V 2% RF Ceramic Capacitor [Digikey: 712-1398-1-ND] 1000 pF 50V 2% NP0 Ceramic Capacitor [Digikey: 478-3760-1-ND] 0.1 µF 25V 10% Ceramic Capacitor [Digikey: PCC1828TR-ND] 1.0 µF 16V 10% Ceramic Capacitor[Digikey: 490-1691-2-ND] 10.0 µF 10V 10% Ceramic Capacitor[Digikey: 709-1228-1-ND] 10.0 uF 16V 10% Ceramic Capacitor [Digikey: 478-5165-2-ND] 47 uF 6.3V 20% Ceramic Capacitor [Digikey: 587-1779-1-ND or 399-5506-1-ND] 1206 - 1206 Surface Mount Capacitors 47uF 10V 20% Ceramic Capacitor [Digikey: 490-5528-1-ND or 399-5508-1-ND or 445-6010-1-ND] 100uF 6.3V -20%, +80% Y5V Ceramic Capacitor (Digikey: 490-4512-1-ND, Mouser: 81-GRM31CF50J107ZE1L)
CI CM DAC RE WE = IVEEDRIS-SCIR:TESTPOINT
D1 = IVEEDRIS-SCIR:SM0805UGC: LED; SMD; 0805; Ultra Green; 563nm; 10mcd; Water Clear Lens; 130 Deg Viewing Angle; DESCRIPTION: Green 565nm LED Indication - Discrete 2V 0805 (2012 Metric); DIGIKEY_PRICE-STOCK: https://www.digikey.es/product-detail/es/bivar-inc/SM0805UGC/492-1329-1-ND/2408561; MANUFACTURER_NAME: Bivar Inc.; MANUFACTURER_PART_NUMBER: SM0805UGC; PACKAGE: 0805 Bivar; SUPPLIER_PART_NUMBER: 492-1329-1-ND
J1 = IVEEDRIS-SCIR:PJ-037A: 2.0 mm Center Pin, 2.5 A, Right Angle, Through Hole, Dc Power Jack Connector Check prices <https://pricing.snapeda.com/parts/PJ-037A/CUI%20Devices/view-part?ref=eda>; DESCRIPTION: 2.0 x 6.5 mm, 2.5 A, Horizontal, Through Hole, Dc Power Jack Connector; DIGIKEY_PRICE-STOCK: https://www.digikey.es/product-detail/es/cui-devices/PJ-037A/CP-037A-ND/1644545; MANUFACTURER_NAME: CUI Devices; MANUFACTURER_PART_NUMBER: PJ-037A; SUPPLIER_PART_NUMBER: CP-037A-ND
J2 = IVEEDRIS-SCIR:FTSH-105-XX-XX-D: 0.050"X0.050" CL THROUGH HOLE TERMINAL STRIP ASSEMBLY,10 PINS.; DESCRIPTION: Connector Header Surface Mount 10 position 0.050 (1.27mm); DIGIKEY_PRICE-STOCK: https://www.digikey.com/es/products/detail/samtec-inc/FTSH-105-04-F-DV/2649990?s=N4IgTCBcDaIMoEECyBGADAVjSgtAOQBEQBdAXyA; MANUFACTURER_NAME: Samtec; MANUFACTURER_PART_NAME: FTSH-105-04-F-D; SUPPLIER_PART_NUMBER: SAM9443-ND
JP1 JP2 = microbuilder:HEADER-1X1: PIN HEADER
L1 = IVEEDRIS-SCIR:PM3308-151M-RC; DIGIKEY_PRICE-STOCK: https://www.digikey.es/product-detail/es/bourns-inc/PM3308-151M-RC/PM3308-151M-RCTR-ND/3782423; MANUFACTURER_NAME: Bourns Electronics; MANUFACTURER_PART_NUMBER: PM3308-151M-RC; SUPPLIER_PART_NUMBER: PM3308-151M-RCTR-ND
L2 L3 = microbuilder:INDUCTOR: Inductors 0603: 10nH Ceramic Inductor - microwire antenna/RF (Digikey: 712-1434-2-ND) 0805: 560nH Ceramic Inductor - RF (Digikey: 553-1047-1-ND) 270nH Ceramic Inductor - Q = 40@250MHz, +-5%, 1 Ohm DC Resistance (Digikey: 535-10506-2-ND) 1007 (2518 Metric) SMT: 10µH 10% 250mOhm 820mA 1007 Inductor (Digikey: 587-2189-1-ND) 22µH 10% 500mOhm 580mA 1007 Inductor (Digikey: 587-2190-1-ND) 47µH 10% 950mOhm 420mA 1007 Inductor (Digikey: 587-2191-1-ND) 47µH 5% 100mOhm 1A 1008 Inductor (Digikey: 732-1816-1-ND) 5.0x5.0mm (Taiyo Yuden NR5040 Series) 6.8µH 20% 2.3A 64mOhm Inductor (Digikey: 587-2374-2-ND) 5.0x5.0mm (TDK VLC5045 Series) 4.7µH 20% 3.3A 34mOhm Inductor (Digikey: 445-6526-1-ND) 6.8µH 20% 2.7A 46mOhm Inductor (Digikey: 445-6527-1-ND) 6.0x6.0mm (TDK VLC6045 Series) 4.7µH 20% 3.8A 27mOhm Inductor (Digikey: 445-6538-2-ND) 6.8µH 20% 3A 41mOhm Inductor (Digikey: 445-6540-1-ND) 6.2µH 30% 2.2A 45mOhm Inductor (Digikey: SRR5028-6R2YCT-ND) - Not TDK VLC6045 but footprint should match 6.0x6.0mm (TDK SLF6045 Series) 6.8uH 30% 2A 33mOhm Inductor (Digikey: 445-4572-1-ND, Mouser: 810-SLF645T6R8N2R0PF)
P1 = IVEEDRIS-SCIR:MOLEX_SL70400_4-PIN; DIGIKEY_PRICE-STOCK: https://www.digikey.es/product-detail/es/molex/0705530038/WM4926-ND/313765; MANUFACTURER_NAME: Molex; MANUFACTURER_PART_NUMBER: 0705530038; SUPPLIER_PART_NUMBER: WM4926-ND
P2 = IVEEDRIS-SCIR:1-316130-2: CONN HDR 5POS R/A KEY-X 15GOLD; DESCRIPTION: Dynamic 3000 Series, 5.08mm Pitch 5 Way Right Angle PCB Header, Solder Term; DIGIKEY_PRICE-STOCK: https://www.digikey.com/es/products/detail/te-connectivity-amp-connectors/1-316130-2/664364?s=N4IgTCBcDaIIwFoDMcBsckAYEQLoF8g; MANUFACTURER_NAME: TE Connectivity AMP Connectors; MANUFACTURER_PART_NUMBER: 1-316130-2; SUPPLIER_PART_NUMBER: A29616-ND
PS1 = IVEEDRIS-SCIR:LM4040DEM3-2.5_NOPB; DIGIKEY_PRICE-STOCK: https://www.digikey.com/es/products/detail/texas-instruments/LM4040DEM3X-2-5-NOPB/367115; MANUFACTURER_NAME: Texas Instruments; MANUFACTURER_PART_NUMBER: LM4040DEM3X-2.5/NOPB; SUPPLIER_PART_NUMBER: 296-LM4040DEM3X-2.5/NOPBTR-ND
PS2 PS3 = IVEEDRIS-SCIR:MCP1702; DIGIKEY_PRICE-STOCK: https://www.digikey.com/es/products/detail/microchip-technology/mcp1702t-5002e-cb/1098473; MANUFACTURER_NAME: Microchip Technology; MANUFACTURER_PART_NAME: MCP1702T-5002E/CB; SUPPLIER_PART_NUMBER: MCP1702T-5002E/CBTR-ND
PS4 PS5 = IVEEDRIS-SCIR:MCP1802T-3302I/OT; MANUFACTURER_NAME: Microchip Technology; MANUFACTURER_PART_NAME: MCP1802T-3302I/OT; MOUSER_PRICE-STOCK: https://www.mouser.es/ProductDetail/Microchip-Technology/MCP1802T-3302I-OT?qs=aE5D7Pt6ky3xGZErL37L5Q%3D%3D; SUPPLIER_PART_NUMBER: 579-MCP1802T-3302IOT
R1-R40 R42-R46 = microbuilder:RESISTOR: Resistors 0402 - 0402 Surface Mount Package 22 Ohm 1% 1/16W [Digikey: 311-22.0LRTR-ND] 33 Ohm 5% 1/16W 1.0K 5% 1/16W 1.5K 5% 1/16W 2.0K 1% 1/16W 10.0K 1% 1/16W [Digikey: 311-10.0KLRTR-ND] 10.0K 5% 1/16W [Digikey: RMCF0402JT10K0TR-ND] 12.1K 1% 1/16W [Digikey: 311-22.0LRTR-ND] 100.0K 5% 1/16W 0603 - 0603 Surface Mount Package 0 Ohm 1/10 Watt 1% Resistor 15 Ohm 1/10 Watt 1% Resistor 33 Ohm 1/10 Watt 1% Resistor 49.9 Ohm 1/10 Watt 1% Resistor 100 Ohm 1/10 Watt 1% Resistor 150 Ohm 1/10 Watt 1% Resistor 240 Ohm 1/10 Watt 1% Resistor 390 Ohm 1/10 Watt 1% Resistor 560 Ohm 1/10 Watt 1% Resistor 680 Ohm 1/10 Watt 1% Resistor 750 Ohm 1/10 Watt 1% Resistor 1.0K Ohm 1/10 Watt 1% Resistor 1.5K Ohm 1/10 Watt 1% Resistor 2.0K Ohm 1/10 Watt 1% Resistor 2.2K Ohm 1/10 Watt 1% Resistor 3.3K Ohm 1/10 Watt 1% Resistor 4.7K Ohm 1/10 Watt 1% Resistor 10.0K Ohm 1/10 Watt 1% Resistor 12.0K Ohm 1/10 Watt 1% Resistor 12.1K Ohm 1/10 Watt 1% Resistor 20.0K Ohm 1/10 Watt 1% Resistor 33.0K Ohm 1/10 Watt 1% Resistor 100.0K Ohm 1/10 Watt 1% Resistor 0805 - 0805 Surface Mount Package 0 Ohm 1/8 Watt 1% Resistor 33 Ohm 1/8 Watt 1% Resistor 100 Ohm 1/8 Watt 1% Resistor 150 Ohm 1/8 Watt 1% Resistor 200 Ohm 1/8 Watt 1% Resistor 240 Ohm 1/8 Watt 1% Resistor 330 Ohm 1/8 Watt 1% Resistor 390 Ohm 1/8 Watt 1% Resistor 470 Ohm 1/8 Watt 1% Resistor 1.0K Ohm 1/8 Watt 1% Resistor 1.5K Ohm 1/8 Watt 1% Resistor 2.0K Ohm 1/8 Watt 1% Resistor 4.7K Ohm 1/8 Watt 1% Resistor 5.1K Ohm 1/8 Watt 1% Resistor 5.6K Ohm 1/8 Watt 1% Resistor 10.0K Ohm 1/8 Watt 1% Resistor 22.0K Ohm 1/8 Watt 1% Resistor 33.0K Ohm 1/8 Watt 1% Resistor 100K Ohm 1/8 Watt 1% Resistor 1206 - 1206 Surface Mount Package 2012 - 2010 Surface Mount Package 0.11 Ohm 1/2 Watt 1% Resistor - Digikey: RHM.11UCT-ND
R41 = microbuilder:RESISTOR: Resistors 0402 - 0402 Surface Mount Package 22 Ohm 1% 1/16W [Digikey: 311-22.0LRTR-ND] 33 Ohm 5% 1/16W 1.0K 5% 1/16W 1.5K 5% 1/16W 2.0K 1% 1/16W 10.0K 1% 1/16W [Digikey: 311-10.0KLRTR-ND] 10.0K 5% 1/16W [Digikey: RMCF0402JT10K0TR-ND] 12.1K 1% 1/16W [Digikey: 311-22.0LRTR-ND] 100.0K 5% 1/16W 0603 - 0603 Surface Mount Package 0 Ohm 1/10 Watt 1% Resistor 15 Ohm 1/10 Watt 1% Resistor 33 Ohm 1/10 Watt 1% Resistor 49.9 Ohm 1/10 Watt 1% Resistor 100 Ohm 1/10 Watt 1% Resistor 150 Ohm 1/10 Watt 1% Resistor 240 Ohm 1/10 Watt 1% Resistor 390 Ohm 1/10 Watt 1% Resistor 560 Ohm 1/10 Watt 1% Resistor 680 Ohm 1/10 Watt 1% Resistor 750 Ohm 1/10 Watt 1% Resistor 1.0K Ohm 1/10 Watt 1% Resistor 1.5K Ohm 1/10 Watt 1% Resistor 2.0K Ohm 1/10 Watt 1% Resistor 2.2K Ohm 1/10 Watt 1% Resistor 3.3K Ohm 1/10 Watt 1% Resistor 4.7K Ohm 1/10 Watt 1% Resistor 10.0K Ohm 1/10 Watt 1% Resistor 12.0K Ohm 1/10 Watt 1% Resistor 12.1K Ohm 1/10 Watt 1% Resistor 20.0K Ohm 1/10 Watt 1% Resistor 33.0K Ohm 1/10 Watt 1% Resistor 100.0K Ohm 1/10 Watt 1% Resistor 0805 - 0805 Surface Mount Package 0 Ohm 1/8 Watt 1% Resistor 33 Ohm 1/8 Watt 1% Resistor 100 Ohm 1/8 Watt 1% Resistor 150 Ohm 1/8 Watt 1% Resistor 200 Ohm 1/8 Watt 1% Resistor 240 Ohm 1/8 Watt 1% Resistor 330 Ohm 1/8 Watt 1% Resistor 390 Ohm 1/8 Watt 1% Resistor 470 Ohm 1/8 Watt 1% Resistor 1.0K Ohm 1/8 Watt 1% Resistor 1.5K Ohm 1/8 Watt 1% Resistor 2.0K Ohm 1/8 Watt 1% Resistor 4.7K Ohm 1/8 Watt 1% Resistor 5.1K Ohm 1/8 Watt 1% Resistor 5.6K Ohm 1/8 Watt 1% Resistor 10.0K Ohm 1/8 Watt 1% Resistor 22.0K Ohm 1/8 Watt 1% Resistor 33.0K Ohm 1/8 Watt 1% Resistor 100K Ohm 1/8 Watt 1% Resistor 1206 - 1206 Surface Mount Package 2012 - 2010 Surface Mount Package 0.11 Ohm 1/2 Watt 1% Resistor - Digikey: RHM.11UCT-ND; SPICEPREFIX: R
RL1-RL10 = IVEEDRIS-SCIR:G6KU-2F-Y; DIGIKEY_PRICE-STOCK: https://www.digikey.com/es/products/detail/omron-electronics-inc-emc-div/G6KU-2F-Y-DC5/1816071; MANUFACTURER_NAME: Omron Electronics Inc-EMC Div; MANUFACTURER_PART_NUMBER: G6KU-2F-Y DC5; SUPPLIER_PART_NUMBER: Z3303-ND
S1-S4 = IVEEDRIS-SCIR:CHS-01TB; DIGIKEY_PRICE_STOCK: https://www.digikey.com/es/products/detail/nidec-copal-electronics/CHS-01TB/948315; MANUFACTURER_NAME: Nidec Copal Electronics; MANUFACTURER_PART_NUMBER: CHS-01TB; SUPPLIER_PART_NUMBER: 563-1004-2-ND
U1 = IVEEDRIS-SCIR:TLV2462IDG4; DIGIKEY_PRICE-STOCK: https://www.digikey.es/product-detail/es/texas-instruments/TLV2462AQDRQ1/296-17738-1-ND/716923; MANUFACTURER_NAME: Texas Instruments; MANUFACTURER_PART_NUMBER: TLV2462AQDRQ1; SUPPLIER_PART_NUMBER: 296-17738-1-ND
U2 = IVEEDRIS-SCIR:MAX3490ECSA+: Interface IC - transceivers Maxim Integrated MAX3490ECSA+ RS422, RS485 1/1 SOIC 8 N; DESCRIPTION: 1/1 Transceiver Full RS422, RS485 8-SOIC; DIGIKEY_PRICE-STOCK: https://www.digikey.com/es/products/detail/maxim-integrated/MAX3490ECSA-T/1703411?s=N4IgTCBcDaILIEEAaBmALATgAwFEDCAyggNQAqpASgLQByAIiALoC%2BQA; MANUFACTURER_NAME: Maxim Integrated; MANUFACTURER_PART_NUMBER: MAX3490ECSA+; PACKAGE: SOIC-8 Maxim; SUPPLIER_PART_NUMBER: MAX3490ECSA+TTR-ND
U3 = IVEEDRIS-SCIR:MKW41Z512VHT4
U4 = IVEEDRIS-SCIR:ADR5043BKSZ-REEL7; BUILT_BY: EMA_Christopher; COPYRIGHT: Copyright (C) 2016 Accelerated Designs. All rights reserved; MANUFACTURER_PART_NUMBER: ADR5043BKSZ-REEL7; SOURCELIBRARY: Analog_Devices_2018-07-13; VENDOR: Analog Devices Inc
U5-U7 = IVEEDRIS-SCIR:74HCT238D: 74HCT238D, Decoder, Demultiplexer HCT, 1-of-8 Non-Inverting 5V 16-Pin SOIC Source: Datasheet <http://www.nxp.com/documents/data_sheet/74HC_HCT238.pdf>; DESCRIPTION: 74HCT238D, Decoder, Demultiplexer HCT, 1-of-8 Non-Inverting 5V 16-Pin SOIC; DIGIKEY_PRICE-STOCK: https://www.digikey.com/es/products/detail/nexperia-usa-inc/74HCT238D652/1023079; HEIGHT: 1.75mm; MANUFACTURER_NAME: Nexperia; MANUFACTURER_PART_NUMBER: 74HCT238D,652; SUPPLIER_PART_NUMBER: 1727-3389-ND
U8-U10 = IVEEDRIS-SCIR:ULN2003LVDR: 7-Ch Relay, Inductive Sink Driver SOIC16 Texas Instruments ULN2003LVDR, 7-element NPN Darlington Transistor Array, 140 mA 8 V, 16-Pin SOIC Source: Datasheet <http://www.ti.com/lit/ds/symlink/uln2003lv.pdf>; DESCRIPTION: 7-Ch Relay, Inductive Sink Driver SOIC16 Texas Instruments ULN2003LVDR, 7-element NPN Darlington Transistor Array, 140 mA 8 V, 16-Pin SOIC; DIGIKEY_PRICE-STOCK: https://www.digikey.es/product-detail/es/texas-instruments/ULN2003LVDR/296-30403-1-ND/3283552; HEIGHT: 1.75mm; MANUFACTURER_NAME: Texas Instruments; MANUFACTURER_PART_NUMBER: ULN2003LVDR; SUPPLIER_PART_NUMBER: 296-30403-1-ND
U11 U13 = IVEEDRIS-SCIR:ADG849: Analog switch.; DIGIKEY_PRICE-STOCK: https://www.digikey.com/es/products/detail/analog-devices-inc/ADG849YKSZ-500RL7/699430; MANUFACTURER_NAME: Analog Devices Inc.; MANUFACTURER_PART_NUMBER: ADG849YKSZ-500RL7; SUPPLIER_PART_NUMBER: ADG849YKSZ500RLTR-ND
U12 U14 U15 = IVEEDRIS-SCIR:OPA4376
Y1 = IVEEDRIS-SCIR:XRCGB32M000FBH50R0: MURATA - XRCGB32M000FBH50R0 - CRYSTAL, 32MHZ, 10PF, SMD, 2MM X 1.6MM Source: Datasheet <https://www.murata.com/en-eu/products/productdetail?partno=XRCGB32M000FBH50R0>; DESCRIPTION: MURATA - XRCGB32M000FBH50R0 - CRYSTAL, 32MHZ, 10PF, SMD, 2MM X 1.6MM; DIGIKEY_PRICE-STOCK: https://www.digikey.es/product-detail/es/murata-electronics/XRCGB32M000FBH50R0/490-18345-1-ND/9959807; MANUFACTURER_NAME: Murata Electronics; MANUFACTURER_PART_NUMBER: XRCGB32M000FBH50R0; SUPPLIER_PART_NUMBER: 490-18345-1-ND